# Altium schematic sheet SAM-M10Q.SchDoc
size A4; Organization: Arribada Initiative; Address1: https://github.com/arribada; Address2: contact@arribada.org; Address3: arribada.org; Address4: UK - Portsmouth; DocumentNumber: 9; SheetNumber: 9; SheetTotal: 12
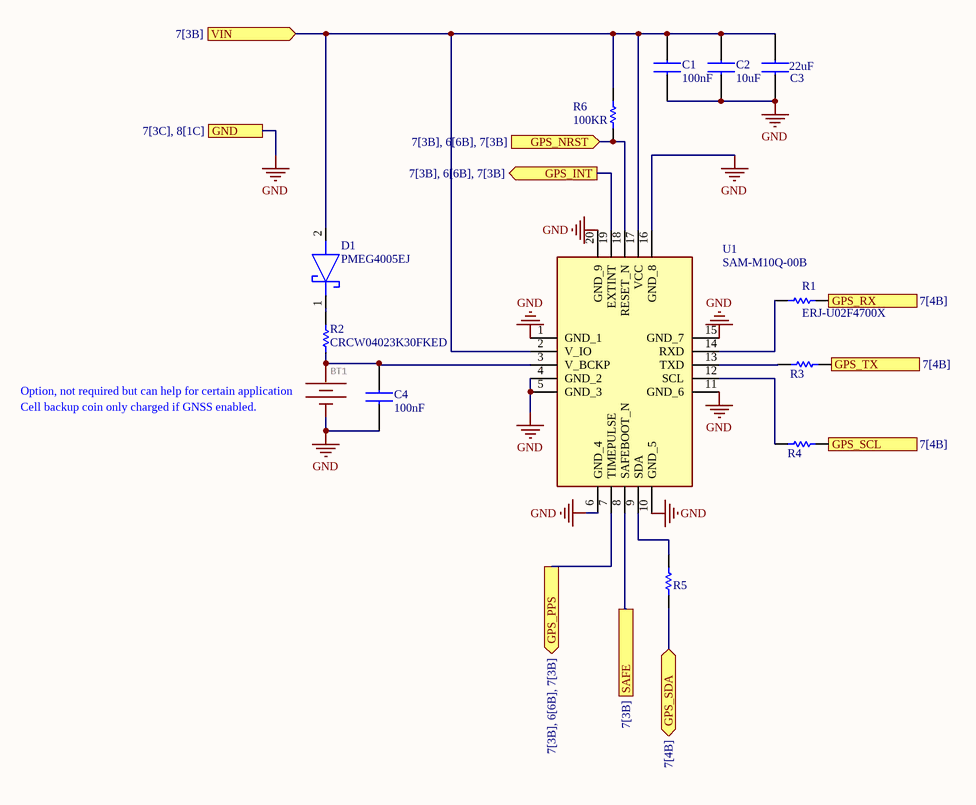
[diagram p0: SAM-M10Q.SchDoc]

## Parts
BT1  6.8MM_COIN_CELL  [MS421R_IV03E]  (value not drawn)
C1  100nF  [CAPC0603X33N]
C2  value 10uF  [CAPC1608X90N]  (hidden comment: GRM188R61A106MAALJ)
C3  value 22uF  [GRM18x]
C4  100nF  [CAPC0603X33N]
D1  PMEG4005EJ  [SOD2512X80N]
R1  ERJ-U02F4700X  [ERJS02_U02_(0402)]
R2  CRCW04023K30FKED  [RESC1005X40N]
R3  ERJ-U02F4700X  [ERJS02_U02_(0402)]  (value not drawn)
R4  ERJ-U02F22R0X  [ERJS02_U02_(0402)]  (value not drawn)
R5  ERJ-U02F22R0X  [ERJS02_U02_(0402)]  (value not drawn)
R6  value 100KR  [ERJPA2_(0402)]  (hidden comment: ERJ-PA2F1003X)
U1  SAM-M10Q-00B  [SAMM10Q00B]

## Ports
GND (see 7[3C], 8[1C]), GPS_INT (out, see 7[3B], 6[6B], 7[3B]), GPS_NRST (in, see 7[3B], 6[6B], 7[3B]), GPS_PPS (out, see 7[3B], 6[6B], 7[3B]), GPS_RX (in, see 7[4B]), GPS_SCL (in, see 7[4B]), GPS_SDA (bidir, see 7[4B]), GPS_TX (out, see 7[4B]), SAFE (see 7[3B]), VIN (in, see 7[3B])

## Nets
GND: BT1.- C1.2 C2.1 C3.1 C4.1 U1.1(GND_1) U1.4(GND_2) U1.5(GND_3) U1.6(GND_4) U1.10(GND_5) U1.11(GND_6) U1.15(GND_7) U1.16(GND_8) U1.20(GND_9) ; port GND
GPS_INT: U1.19(EXTINT) ; port GPS_INT
GPS_NRST: R6.2 U1.18(RESET_N) ; port GPS_NRST
GPS_PPS: U1.7(TIMEPULSE) ; port GPS_PPS
GPS_RX: R1.2 ; port GPS_RX
GPS_SCL: R4.2 ; port GPS_SCL
GPS_SDA: R5.1 ; port GPS_SDA
GPS_TX: R3.2 ; port GPS_TX
SAFE: U1.8(SAFEBOOT_N) ; port SAFE
VIN: C1.1 C2.2 C3.2 D1.2(A) R6.1 U1.2(V_IO) U1.17(VCC) ; port VIN
NetBT1_+: BT1.+ C4.2 R2.1 U1.3(V_BCKP)
NetD1_1: D1.1(K) R2.2
NetR1_1: R1.1 U1.14(RXD)
NetR3_1: R3.1 U1.13(TXD)
NetR4_1: R4.1 U1.12(SCL)
NetR5_2: R5.2 U1.9(SDA)

## Notes on the sheet
- (near BT1) Option, not required but can help for certain application
- (near BT1) Cell backup coin only charged if GNSS enabled.
- Title
- Size:
- Date:
- A4
- Reference:
- Time:
- Revision:
- Sheet
- of
- File:

## Library data of the parts
BT1 = RELOWABLE_BATTERY_MS421R: SEIKO Reflowable Lithium Batteries; GateName_1: G$1; PROD_ID: BAT-16685; SymbolName_1: BATTERY; DeviceName: _MS421R; LibraryName: SparkFun-Batteries; DeviceSetName: RELOWABLE_BATTERY
C1 C4 = GRM033Z71C104KE14D: Multilayer Ceramic Capacitors MLCC - SMD/SMT .1UF     16V   10%        0201; Manufacturer_Name: Murata Electronics; Manufacturer 1: Murata; Geometry.Height: 0.33mm; Description 1: Cap Ceramic 0.1uF 16V X7R 10% Pad SMD 0201 125C T/R; Value: 0.1uF; Mouser Part Number: 81-GRM033Z71C104KE4D; Mouser Price/Stock: https://www.mouser.co.uk/ProductDetail/Murata-Electronics/GRM033Z71C104KE14D?qs=lEfY3O89AqkdMqrSfAAk2w%3D%3D; Manufacturer_Part_Number: GRM033Z71C104KE14D; Datasheet Link: http://www.murata.com/~/media/webrenewal/support/library/catalog/products/capacitor/mlcc/c02e.pdf; Supplier 1: Mouser; Supplier Part Number 1: 81-GRM033Z71C104KE4D; Manufacturer Part Number 1: GRM033Z71C104KE14D; RoHS 1: Yes; Category 1: Ceramic Capacitors; Stock 1: 739403; Pricing 1: 1=0,1, 10=0,017, 50=0,017, 100=0,01, 1000=0,008, 10000=0,006 (USD); Case/Package: 0201; RoHS Compliant: Yes
C2 = GRM188R61A106MAALJ: Multilayer Ceramic Capacitors MLCC - SMD/SMT 10 uF 10 VDC 20% 0603 X5R; Manufacturer_Name: Murata Electronics; Datasheet Link: https://psearch.en.murata.com/capacitor/product/GRM188R61A106MAAL%23.html; Height: 0.9mm; Manufacturer_Part_Number: GRM188R61A106MAALJ; Mouser Part Number: 81-GRM188R61A106MALJ; Mouser Price/Stock: https://www.mouser.co.uk/ProductDetail/Murata-Electronics/GRM188R61A106MAALJ?qs=hNud%2FORuBR0Lq8imX%2F1lYQ%3D%3D; Arrow Part Number: GRM188R61A106MAALJ; Arrow Price/Stock: https://www.arrow.com/en/products/grm188r61a106maalj/murata-manufacturing
C3 = GRM188R61A226ME15D: Multilayer Ceramic Capacitors MLCC - SMD/SMT 22 uF 10 VDC 20% 0603 X5R; Manufacturer_Name: Murata Electronics; Datasheet Link: https://search.murata.co.jp/Ceramy/image/img/A01X/G101/ENG/GRM188R61A226ME15-02A.pdf; Height: 0.8mm; Manufacturer_Part_Number: GRM188R61A226ME15D; Mouser Part Number: 81-GRM188R61A226ME5D; Mouser Price/Stock: https://www.mouser.co.uk/ProductDetail/Murata-Electronics/GRM188R61A226ME15D?qs=eeBpzGFlv%252B8DV%2FrilzyhAw%3D%3D; Arrow Part Number: GRM188R61A226ME15D; Arrow Price/Stock: https://www.arrow.com/en/products/grm188r61a226me15d/murata-manufacturing?region=nac
D1 = PMEG4005EJ: Schottky Diodes & Rectifiers; Manufacturer_Name: Nexperia; Datasheet Link: https://datasheet.datasheetarchive.com/originals/distributors/Datasheets-25/DSA-487592.pdf; Height: 0.8mm; Manufacturer_Part_Number: PMEG4005EJ; Mouser Part Number: N/A; Mouser Price/Stock: https://www.mouser.com/Search/Refine.aspx?Keyword=N%2FA
R1 R3 = ERJ-U02F4700X: Thick Film Resistors - SMD 1/20watt 470ohms 1% 200ppm; Manufacturer_Name: Panasonic; Value: 470R; Datasheet Link: https://industrial.panasonic.com/cdbs/www-data/pdf/RDP0000/AOA0000C334.pdf; Height: 0.4mm; Manufacturer_Part_Number: ERJ-U02F4700X; Mouser Part Number: 667-ERJ-U02F4700X; Mouser Price/Stock: https://www.mouser.co.uk/ProductDetail/Panasonic/ERJ-U02F4700X?qs=CBysBIMljtjEviQOZxHkmQ%3D%3D
R2 = CRCW04023K30FKED: Thick Film Resistors - SMD 1/16watt 3.3Kohms 1% 100ppm; Manufacturer_Name: Vishay; Value: 3.3KR; Datasheet Link: http://www.vishay.com/docs/20035/dcrcwe3.pdf; Height: 0.4mm; Manufacturer_Part_Number: CRCW04023K30FKED; Mouser Part Number: 71-CRCW0402-3.3K-E3; Mouser Price/Stock: https://www.mouser.co.uk/ProductDetail/Vishay-Dale/CRCW04023K30FKED?qs=iv%252Be0Bc5VY2uvlCcTQHBWQ%3D%3D; Arrow Part Number: CRCW04023K30FKED; Arrow Price/Stock: https://www.arrow.com/en/products/crcw04023k30fked/vishay
R4 R5 = ERJ-U02F22R0X: Thick Film Resistors - SMD 1/20watt 22ohms 1% 200ppm; Manufacturer_Name: Panasonic; Value: 22R; Datasheet Link: https://industrial.panasonic.com/cdbs/www-data/pdf/RDP0000/AOA0000C334.pdf; Height: 0.4mm; Manufacturer_Part_Number: ERJ-U02F22R0X
R6 = ERJ-PA2F1003X: Thick Film Resistors - SMD HP02 (0402) 1/5W 1% 100kR T/R-10000; Manufacturer_Name: Panasonic; Datasheet Link: http://industrial.panasonic.com/cdbs/www-data/pdf/RDO0000/AOA0000C331.pdf; Height: 0.4mm; Manufacturer_Part_Number: ERJ-PA2F1003X; Mouser Part Number: 667-ERJ-PA2F1003X; Mouser Price/Stock: https://www.mouser.co.uk/ProductDetail/Panasonic/ERJ-PA2F1003X?qs=h9NfwcE6J0KLQ3ykWSuIfQ%3D%3D
U1 = SAM-M10Q-00B: GNSS / GPS Modules u-blox M10 GNSS antenna module ROM, TCXO, SAW, LNA LGA, 16x16 mm; Datasheet Link: https://content.u-blox.com/sites/default/files/documents/SAM-M10Q_DataSheet_UBX-22013293.pdf; Height: 6.8mm; Manufacturer_Name: U-Blox; Manufacturer_Part_Number: SAM-M10Q-00B; Mouser Part Number: 377-SAM-M10Q-00B; Mouser Price/Stock: https://www.mouser.co.uk/ProductDetail/u-blox/SAM-M10Q-00B?qs=vvQtp7zwQdOaA6LplTUKjg%3D%3D